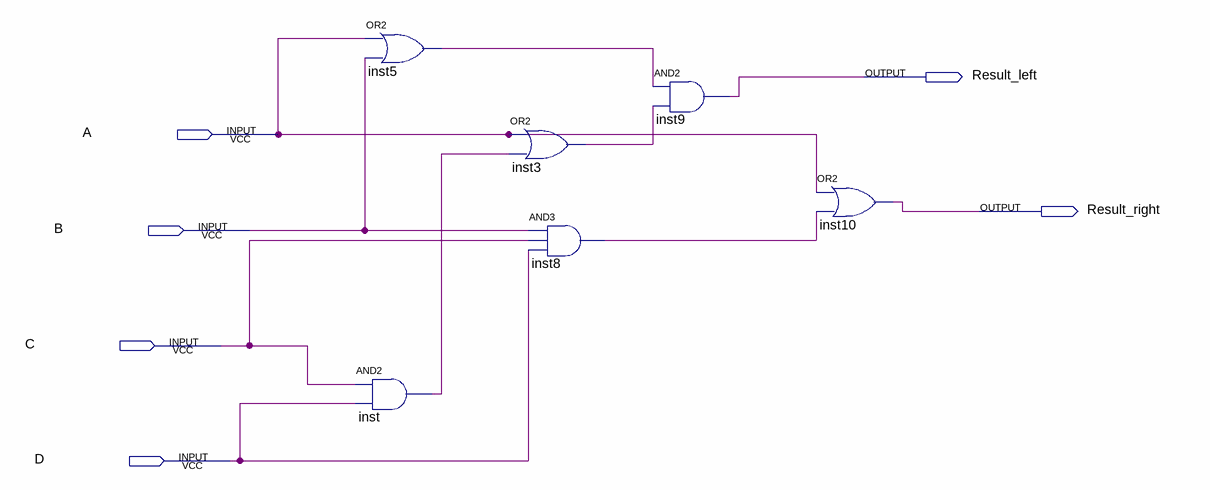
[diagram p0: schematic sheet]
// Quartus schematic hw2.bdf as structural Verilog: 6 symbols, 6 pins
module hw2 (
  input  A,
  input  B,
  input  C,
  input  D,
  output Result_left,
  output Result_right
);

  wire inst3_out, inst5_out, inst8_out, inst_out;

  or inst5 (inst5_out, A, B);
  and inst (inst_out, C, D);
  or inst3 (inst3_out, A, inst_out);
  and inst8 (inst8_out, B, C, D);
  and inst9 (Result_left, inst5_out, inst3_out);
  or inst10 (Result_right, A, inst8_out);
endmodule
